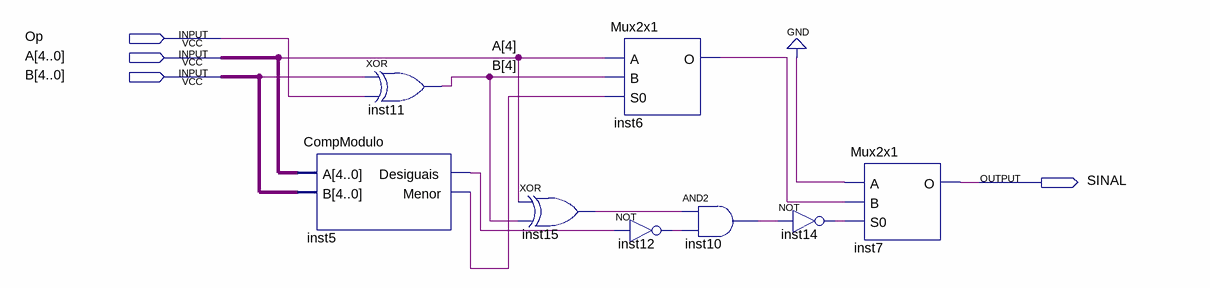
[diagram p0: schematic sheet]
// Quartus schematic sinalSumESub.bdf as structural Verilog: 8 symbols, 4 pins
module sinalSumESub (
  input  Op,
  input  [4:0] A,
  input  [4:0] B,
  output SINAL
);

  wire inst5_desiguais, inst5_menor, inst6_o, inst10_out, inst11_out, inst12_out, inst14_out, inst15_out;

  CompModulo inst5 (.A(A), .B(B), .Desiguais(inst5_desiguais), .Menor(inst5_menor));
  xor inst11 (inst11_out, B[4], Op);
  xor inst15 (inst15_out, A[4], inst11_out);
  Mux2x1 inst6 (.A(A[4]), .B(inst11_out), .S0(inst5_menor), .O(inst6_o));
  not inst12 (inst12_out, inst5_desiguais);
  and inst10 (inst10_out, inst15_out, inst12_out);
  not inst14 (inst14_out, inst10_out);
  Mux2x1 inst7 (.A(1'b0), .B(inst6_o), .S0(inst14_out), .O(SINAL));
endmodule
